# Altium schematic sheet TestPanel.SchDoc
size A
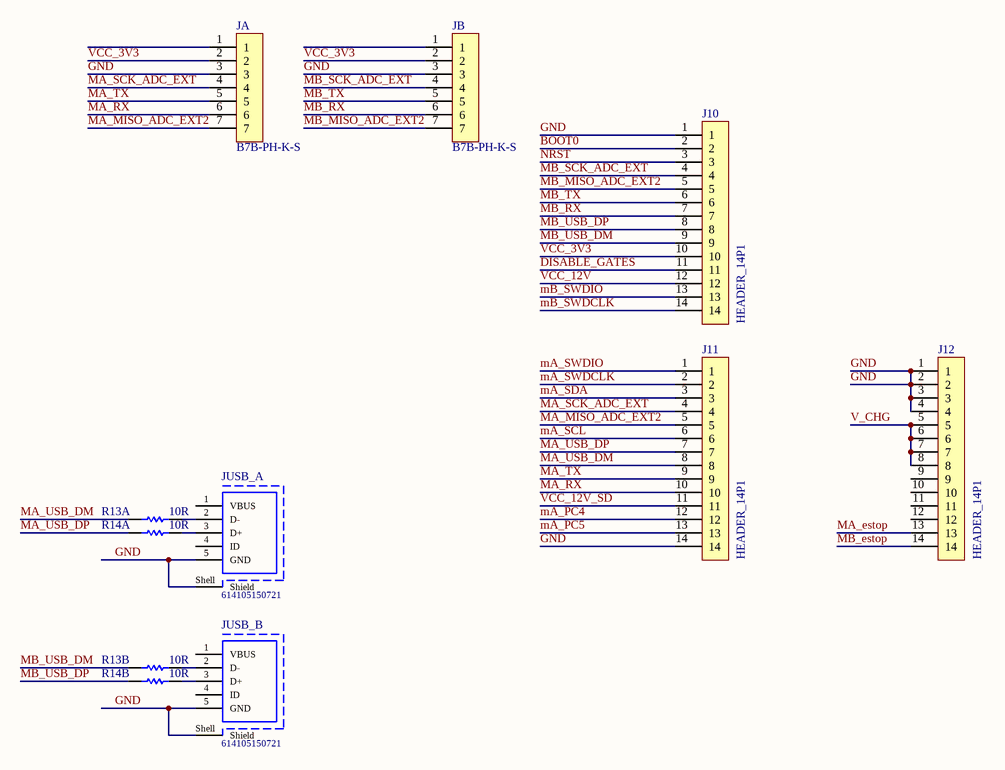
[diagram p0: TestPanel.SchDoc]

## Parts
J10  HEADER_14P1  [HEADER_14P1_FEMALE_TH]
J11  HEADER_14P1  [HEADER_14P1_FEMALE_TH]
J12  HEADER_14P1  [HEADER_14P1_FEMALE_TH]
JA  B7B-PH-K-S  [B7B-PH-K-S]
JB  B7B-PH-K-S  [B7B-PH-K-S]
JUSB_A  614105150721  [614105150721]
JUSB_B  614105150721  [614105150721]
R13A  value 10R  [RES 0402]  (hidden comment: ERJ-2RKF10R0X)
R13B  value 10R  [RES 0402]  (hidden comment: ERJ-2RKF10R0X)
R14A  value 10R  [RES 0402]  (hidden comment: ERJ-2RKF10R0X)
R14B  value 10R  [RES 0402]  (hidden comment: ERJ-2RKF10R0X)

## Nets
BOOT0: J10.2
DISABLE_GATES: J10.11
GND: J10.1 J11.14 J12.1 J12.2 J12.3 J12.4 JA.3 JB.3 JUSB_A.5(GND) JUSB_A.Shell(Shield) JUSB_B.5(GND) JUSB_B.Shell(Shield)
MA_estop: J12.13
MA_MISO_ADC_EXT2: J11.5 JA.7
mA_PC4: J11.12
mA_PC5: J11.13
MA_RX: J11.10 JA.6
MA_SCK_ADC_EXT: J11.4 JA.4
mA_SCL: J11.6
mA_SDA: J11.3
mA_SWDCLK: J11.2
mA_SWDIO: J11.1
MA_TX: J11.9 JA.5
MA_USB_DM: J11.8 R13A.1
MA_USB_DP: J11.7 R14A.1
MB_estop: J12.14
MB_MISO_ADC_EXT2: J10.5 JB.7
MB_RX: J10.7 JB.6
MB_SCK_ADC_EXT: J10.4 JB.4
mB_SWDCLK: J10.14
mB_SWDIO: J10.13
MB_TX: J10.6 JB.5
MB_USB_DM: J10.9 R13B.1
MB_USB_DP: J10.8 R14B.1
NRST: J10.3
V_CHG: J12.5 J12.6 J12.7 J12.8
VCC_3V3: J10.10 JA.2 JB.2
VCC_12V: J10.12
VCC_12V_SD: J11.11
NetJUSB_A_2: JUSB_A.2(D-) R13A.2
NetJUSB_A_3: JUSB_A.3(D+) R14A.2
NetJUSB_B_2: JUSB_B.2(D-) R13B.2
NetJUSB_B_3: JUSB_B.3(D+) R14B.2

Not connected (* = marked no-connect by the designer): J12 9 10 11 12; JA 1; JB 1; JUSB_A 1(VBUS) 4(ID); JUSB_B 1(VBUS) 4(ID)

## Library data of the parts
J10-J12 = HEADER_14P1: 2.54mm Header 14 Pin 1 Row
JA JB = B7B-PH-K-S: 2mm JST SOCKET 7 Pin
JUSB_A JUSB_B = 614105150721: Micro USB 2.0 Type B Receptacle WR-COM, Vertical, THT; Rated Current: 1.8 A; Contact Resistance: 30 mOhm; Working Voltage: 30 VAC; ComponentLink1Description: Manufacturer; ComponentLink1URL: http://www.we-online.de; ComponentLink2Description: Datasheet; ComponentLink2URL: https://katalog.we-online.de/em/datasheet/614105150721.pdf; Part Number: 614105150721; Published Date: September 2018; Publisher: Wurth Elektronik; Orientation: Vertical; Connector Type: Micro USB 2.0 Type B; Operating Temperature: -40 to 85 degC; Mounting Technology: THT; Gender: Receptacle; Packaging: Tape and Reel
R13A R13B R14A R14B = ERJ-2RKF10R0X: RES 0402 10R 1%